# Altium schematic sheet Connectors.SchDoc
size A; SheetNumber: 13
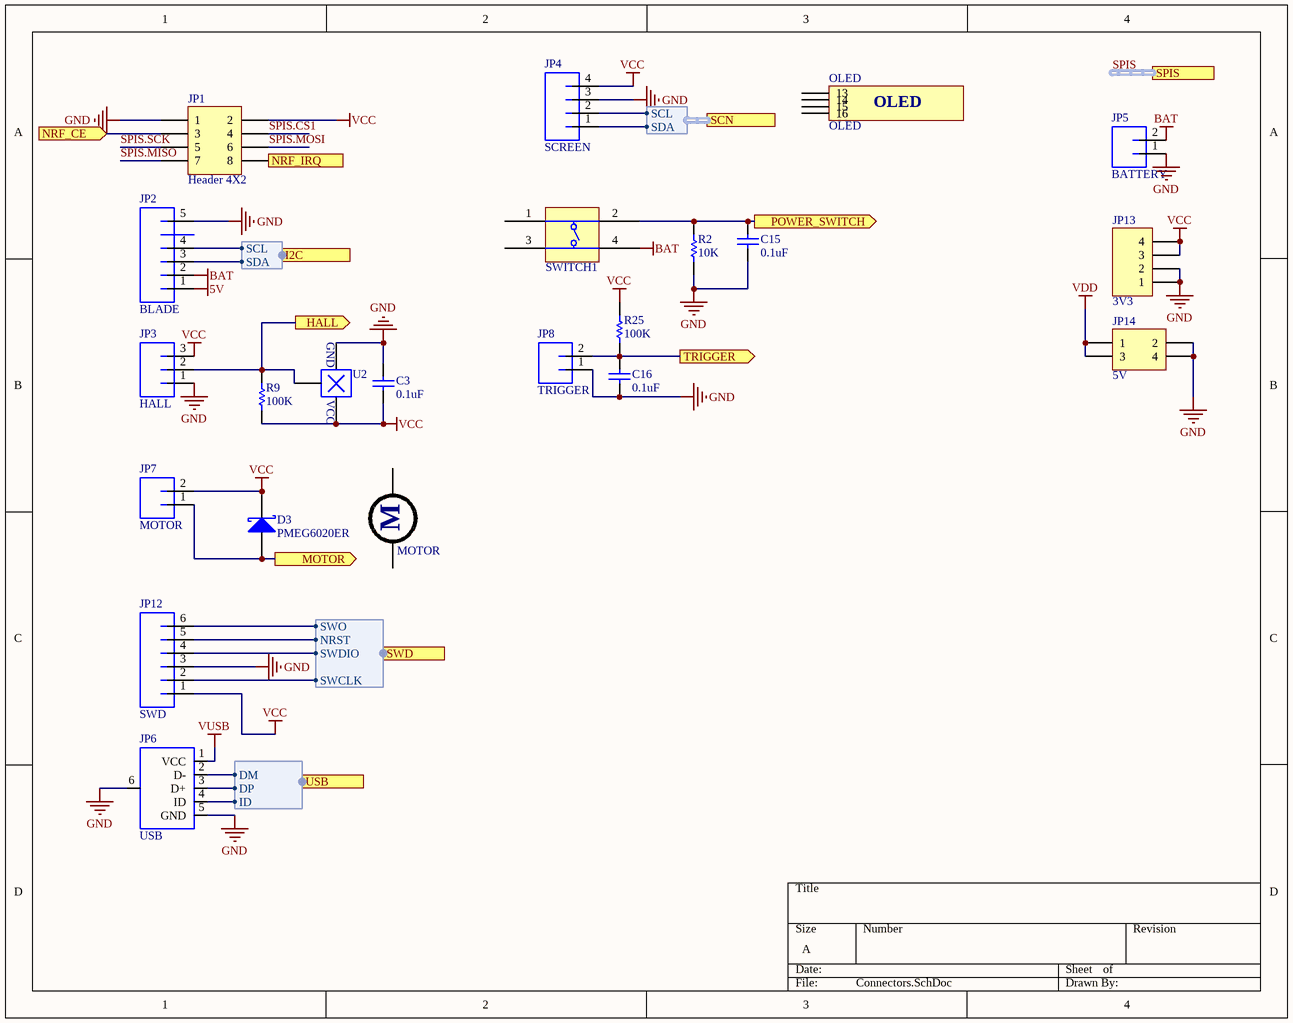
[diagram p0: Connectors.SchDoc]

## Parts
*  MOTOR  (mechanical)
C3  value 0.1uF  [C0603[1608X92]]  (hidden comment: 0.1uF 6.3V 0603)
C15  value 0.1uF  [C0603[1608X92]]  (hidden comment: 0.1uF 6.3V 0603)
C16  value 0.1uF  [C0603[1608X92]]  (hidden comment: 0.1uF 6.3V 0603)
D3  PMEG6020ER  [SOD-123]
JP1  Header 4X2  [HDR2X4]
JP2  BLADE  [TE_1473971-2]
JP3  HALL  [JST-PH-3-PTH-HORZ]
JP4  SCREEN  [JST-PH-4-PTH-HORZ]
JP5  BATTERY  [JST-PH-2-PTH-HORZ]
JP6  USB  [USB-MICROB_HORZ]
JP7  MOTOR  [JST-PH-2-PTH-HORZ]
JP8  TRIGGER  [JST-PH-2-PTH-HORZ]
JP12  SWD  [MOLEX_5045_6]
JP13  3V3  [HDR1X4]
JP14  5V  [HDR2X2]
OLED  OLED
R2  value 10K  [R0603[1608]]  (hidden comment: 10K 1% 0603)
R9  value 100K  [R0603[1608]]  (hidden comment: 100K 1% 0603)
R25  value 100K  [R0603[1608]]  (hidden comment: 100K 1% 0603)
SWITCH1  DIPT-DTSM-6  [SWITCH]  (value not drawn)
U2  HALL_SENSOR  [SOT23-3]  (value not drawn)

## Ports
HALL (out), I2C (harness I2C), MOTOR (out), NRF_CE (in), NRF_IRQ (out), POWER_SWITCH (out), SCN (harness I2C), SPIS (harness SPI), SWD (harness SWD), TRIGGER (out), USB (harness USB)

## Harnesses
USB: DM, DP, ID
SWD: SWCLK, SWDIO, SWO, NRST
I2C: SCL, SDA

## Nets
5V: JP2.1
BAT: JP2.2 JP5.2 SWITCH1.4
GND: C3.2 C15.1 C16.1 JP1.1 JP2.5 JP3.1 JP4.3 JP5.1 JP6.5(GND) JP6.6(SHIELD) JP8.1 JP12.3 JP13.1 JP13.2 JP14.2 JP14.4 R2.1 U2.2(GND)
VCC: C3.1 D3.1(K) JP1.2 JP3.3 JP4.4 JP7.2 JP12.1 JP13.3 JP13.4 R9.1 R25.2 U2.1(VCC)
VDD: JP14.1 JP14.3
VUSB: JP6.1(VCC)
HALL: JP3.2 R9.2 U2.3(OUT) ; port HALL
MOTOR: D3.2(A) JP7.1 ; port MOTOR
NRF_CE: JP1.3 ; port NRF_CE
NRF_IRQ: JP1.8 ; port NRF_IRQ
POWER_SWITCH: C15.2 R2.2 SWITCH1.2 ; port POWER_SWITCH
SPIS.CS1: JP1.4
SPIS.MISO: JP1.7
SPIS.MOSI: JP1.6
SPIS.SCK: JP1.5
TRIGGER: C16.2 JP8.2 R25.1 ; port TRIGGER
NetJP2_3: JP2.3 ; port I2C.SDA
NetJP2_4: JP2.4 ; port I2C.SCL
NetJP4_1: JP4.1 ; port SCN.SDA
NetJP4_2: JP4.2 ; port SCN.SCL
NetJP6_2: JP6.2(D-) ; port USB.DM
NetJP6_3: JP6.3(D+) ; port USB.DP
NetJP6_4: JP6.4(ID) ; port USB.ID
NetJP12_2: JP12.2 ; port SWD.SWCLK
NetJP12_4: JP12.4 ; port SWD.SWDIO
NetJP12_5: JP12.5 ; port SWD.NRST
NetJP12_6: JP12.6 ; port SWD.SWO

Not connected (* = marked no-connect by the designer): * 15 16; OLED 13 14 15 16; SWITCH1 1 3

## Buses and harness runs
harness SPIS = port SPIS

## Notes on the sheet
- (in symbol MOTOR) M

## Library data of the parts
* = MOTOR: PartNumber: 316040001; Manufacturer: SEEED
C3 C15 C16 = CAP_0.1uF_6.3V_0603_10%: 0.1uF 6.3V 10% 0603 (1608 Metric); PartNumber: GRM188R70J104KA01D; Manufacturer: Murata; Mounting Technology: Surface Mount; PackageReference: 0603; PackageDescription: 0603 (1608 Metric); Voltage: 6.3V; Tolerance: 10%
D3 = PMEG6020ER: PartNumber: PMEG6020ER,115; Manufacturer: NXP Semiconductors; PackageDescription: SOD, 2-Leads, Body 2.69x1.6mm; PackageReference: SOD-123W; Mounting Technology: Surface Mount
JP1 = Header 4X2: Header, 4-Pin, Dual row; LatestRevisionDate: 17-Jul-2002; LatestRevisionNote: Re-released for DXP Platform.; Publisher: Altium Limited
JP2 = TE_MDI_1473971-2: BLADE CONNECTOR, 5 PIN, FEMALE, HORIZ; Manufacturer: TE Connectivity; PartNumber: 1473971-2; Mounting Technology: Through Hole
JP3 = JST_PH_3_HORZ: Manufacturer: JST Sales America Inc.; PartNumber: B3B-PH-K-S(LF)(SN); Mounting Technology: Through Hole; PackageReference: JST-PH
JP4 = JST_PH_4_HORZ: PartNumber: S4B-PH-K-S(LF)(SN); Manufacturer: JST Sales America Inc.; PackageReference: JST-PH; Mounting Technology: Through Hole
JP5 JP7 JP8 = JST_PH_2_HORZ: Manufacturer: JST Sales America Inc.; PartNumber: B2B-PH-K-S(LF)(SN); Mounting Technology: Through Hole; PackageReference: JST-PH
JP6 = USB_MICROB_HORZ: pin to pad: 1>VBUS 2>D- 3>D+ 4>ID 5>GND 6>MT1+P$1+P$2+MT2; PartNumber: 10118192-0001LF; Manufacturer: Amphenol FCI; Mounting Technology: Surface Mount; PackageReference: USB - Micro B
JP12 = MOLEX_5045_6: PartNumber: B6B-PH-K-S(LF)(SN); Manufacturer: JST Sales America Inc.; PackageReference: JST-PH; Mounting Technology: Through Hole
JP13 = Header 4: Header, 4-Pin; LatestRevisionDate: 17-Jul-2002; LatestRevisionNote: Re-released for DXP Platform.; Publisher: Altium Limited
JP14 = Header 2X2: Header, 2-Pin, Dual row; LatestRevisionDate: 17-Jul-2002; LatestRevisionNote: Re-released for DXP Platform.; Publisher: Altium Limited
OLED = OLED: PartNumber: 0.91inch OLED Module; Manufacturer: Waveshare
R2 = RES_10K_0603_1%: 10K 0.25W 1% 0603 (1005 Metric); Manufacturer: Vishay / Dale; PartNumber: CRCW060310K0FKEAHP; Tolerance: 1%; Power: 0.25W; Mounting Technology: Surface Mount; PackageReference: 0603; PackageDescription: 0603 (1608 Metric); ComponentLink1Description: Datasheet; ComponentLink1URL: http://www.vishay.com/docs/20065/rcse3.pdf
R9 R25 = RES_100K_0603_1%: 100K 0.25W 1% 0603 (1005 Metric); Manufacturer: Vishay / Dale; PartNumber: CRCW0603100KFKEAHP; Tolerance: 1%; Power: 0.25W; Mounting Technology: Surface Mount; PackageReference: 0603; PackageDescription: 0603 (1608 Metric); ComponentLink1Description: Datasheet; ComponentLink1URL: http://www.vishay.com/docs/20043/crcwhpe3.pdf
SWITCH1 = DIPT-DTSM-6: Switch, SPNO Push Button SMD; Manufacturer: C&K Components; PartNumber: PTS810 SJM 250 SMTR LFS; PackageReference: PTS810
U2 = HALL_SENSOR: PartNumber: DRV5055A2; Manufacturer: Texas Instruments; Mounting Technology: Surface Mount; PackageReference: 2012; PackageDescription: SOT-23-3